# EAGLE design lm386_nogainctl (EAGLE 7.4.0)
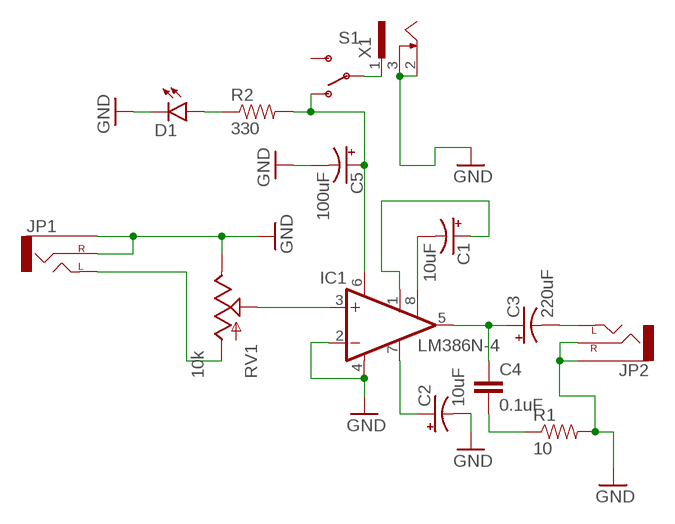
[diagram p0: schematic, sheet 1]

## Parts
C1  10uF  CAP_POLPTH2  [CPOL-RADIAL-10UF-25V]
C2  10uF  CAP_POLPTH2  [CPOL-RADIAL-10UF-25V]
C3  220uF  CAP_POLPTH2  [CPOL-RADIAL-10UF-25V]
C4  0.1uF  CAPPTH2  [CAP-PTH-SMALL2]
C5  100uF  100UF-25V-20%(PTH)  [CPOL-RADIAL-100UF-25V]
D1  LED3MM  [LED3MM]
IC1  LM386N-4  [DIL08]
JP1  AUDIO-JACKPTH  [AUDIO-JACK]
JP2  AUDIO-JACKPTH  [AUDIO-JACK]
R1  10  RESISTORPTH-1/4W  [AXIAL-0.4]
R2  330  RESISTORPTH-1/4W  [AXIAL-0.4]
RV1  10k  POT  [ALPS_POT]
S1  SWITCH-SPDTPTH_LOCK  [SWITCH-SPDT_LOCK.007S]
X1  SCD-014A  [SCD-014-A]

## Nets
GND: C2.2(-) C5.2(-) D1.K(C) IC1.2(-IN) IC1.4(GND) JP1.RING(RIGHT) JP1.SLEEVE JP2.RING(RIGHT) JP2.SLEEVE R1.P$2 RV1.P$1(E) X1.2 X1.3
N$1: JP1.TIP(LEFT) RV1.P$3(A)
N$2: IC1.3(+IN) RV1.P$2(S)
N$3: S1.2(P) X1.1
N$4: C5.1(+) IC1.6(VS) R2.P$2 S1.1(O)
N$5: C1.1(+) IC1.1(GAIN)
N$6: C1.2(-) IC1.8(GAIN)
N$7: C2.1(+) IC1.7(BYPASS)
N$8: C3.1(+) C4.1 IC1.5(OUT)
N$9: C4.2 R1.P$1
N$10: D1.A R2.P$1
N$11: C3.2(-) JP2.TIP(LEFT)
Unconnected: S1.3(S)

## Library data of the parts
C1-C3 = SparkFun-Passives:CAP_POL: Capacitor Polarized These are standard SMD and PTH capacitors. Normally 10uF, 47uF, and 100uF in electrolytic and tantalum varieties. Always verify the external diameter of the through hole cap, it varies with capacity, voltage, and manufacturer. The EIA devices should be standard.
C4 = SparkFun-Capacitors:CAP: Capacitor Standard 0603 ceramic capacitor, and 0.1" leaded capacitor.
C5 = SparkFun-Capacitors:100UF-25V-20%(PTH): CAP-08439; PROD_ID: CAP-08439
D1 = SparkFun-LED:LED: LEDs Standard schematic elements and footprints for 5mm, 3mm, 1206, and 0603 sized LEDs. 5mm - Spark Fun Electronics SKU : COM-00529 (and others)
IC1 = linear:LM386?-*: Low Voltage Audio Power Amplifier Source: http://cache.national.com/ds/LM/LM386.pdf
JP1 JP2 = SparkFun-Connectors:AUDIO-JACK: 3.5mm Audio Jack Simple 3.5mm common PCB mount audio jack. Variant PTH is our storefront SKU PRT-08032
R1 = SparkFun-Passives:RESISTOR: Resistor Basic schematic elements and footprints for 0603, 1206, and PTH resistors.
R2 = SparkFun-Resistors:RESISTOR: Resistor Basic schematic elements and footprints for 0603, 1206, and PTH resistors.
RV1 = SparkFun-Electromechanical:POT; PROD_ID: RES-09177
S1 = SparkFun-Electromechanical:SWITCH-SPDT: SPDT Switch Simple slide switch, Spark Fun Electronics SKU : COM-00102 DPDT SMT slide switch, AYZ0202, SWCH-08179
X1 = con-shiua-chyuan:SCD-014A: Power Jack 2.5mm; OC_FARNELL: unknown; OC_NEWARK: unknown

## Board
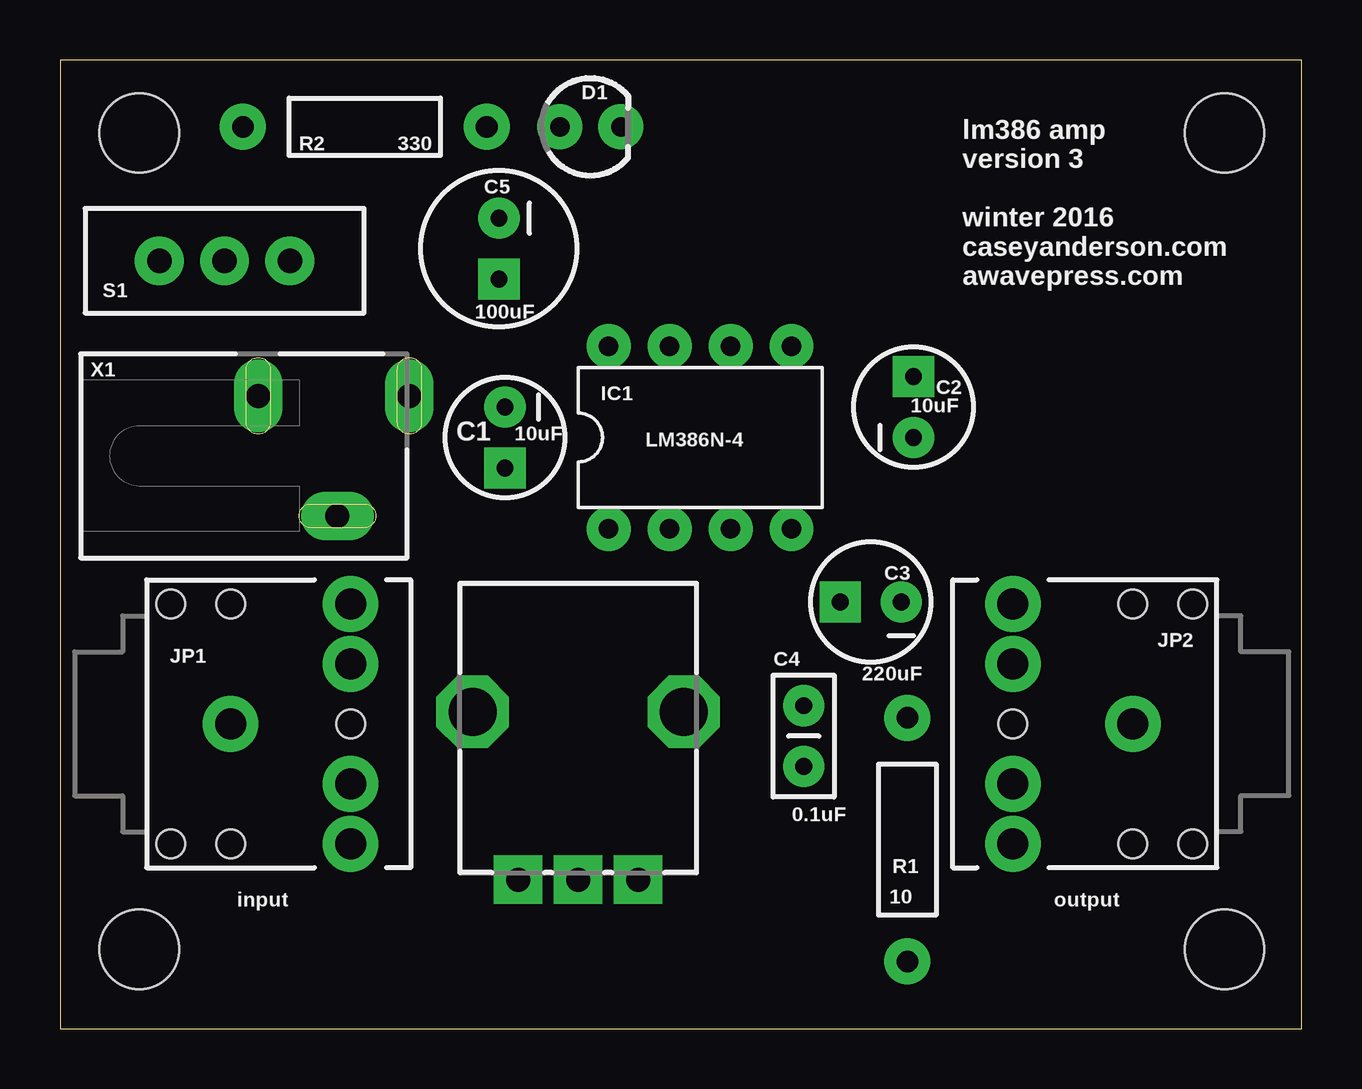
[diagram p1: board, top side]
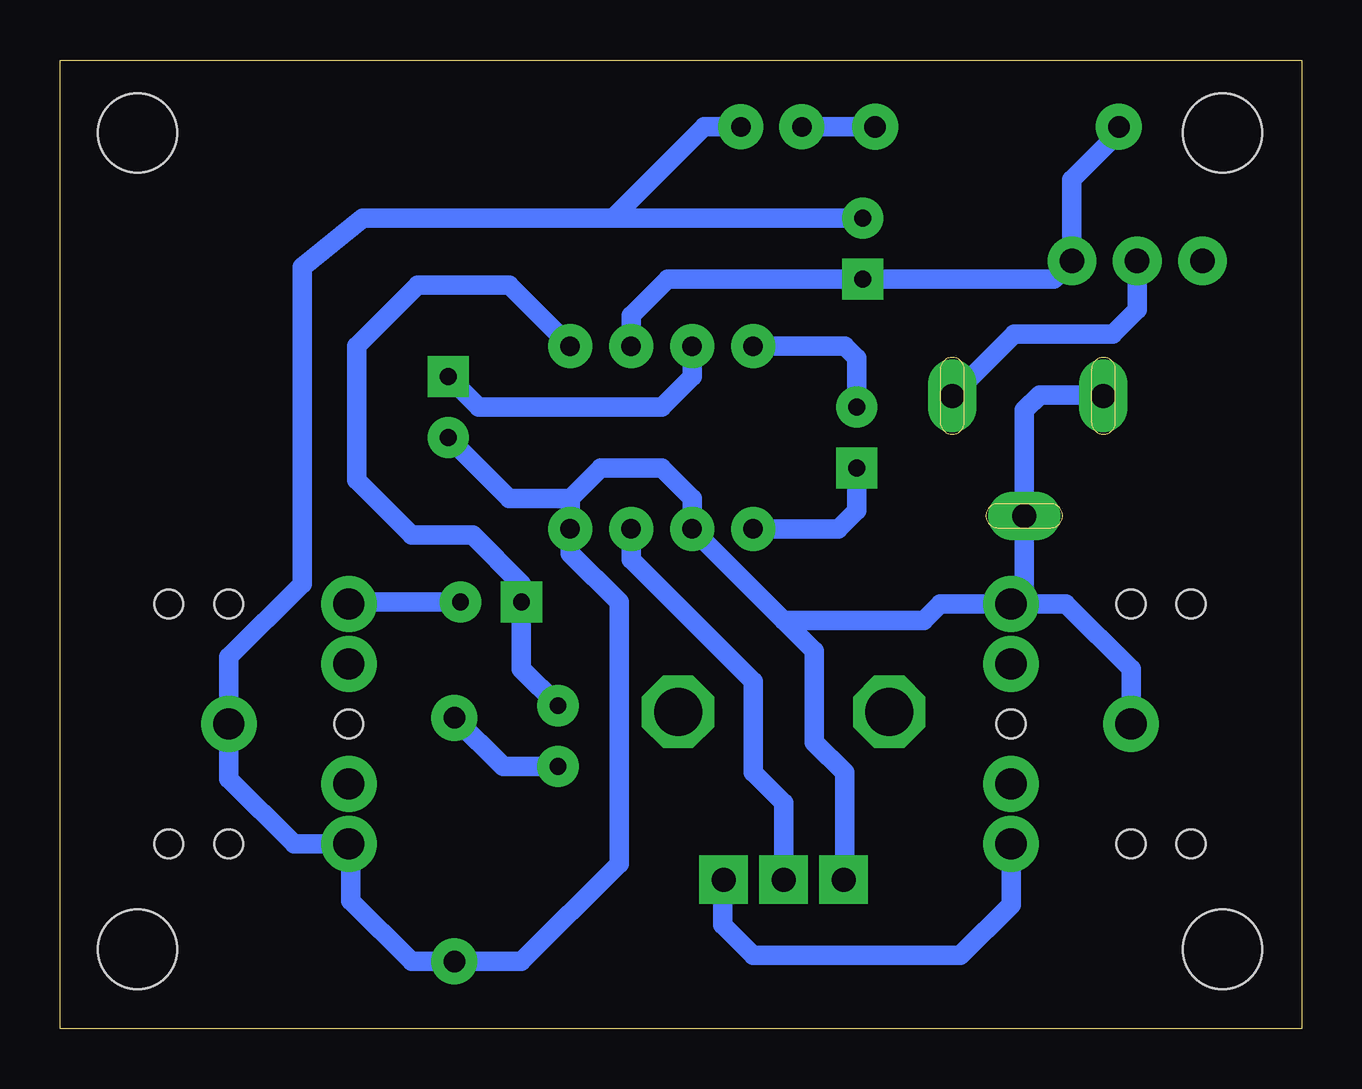
[diagram p2: board, bottom side, seen from below]

Size 51.74 x 40.38 mm. Coordinates in mm from the lower left corner, seen from the top.
Outline: 0,0 51.74,0 51.74,40.38 0,40.38 0,0
Copper layers (1*16): Top 0.035mm / dielectric 1.5mm / Bottom 0.035mm
Design rules "Othermill-DRC-1-64 *": minimum track width 8mil, minimum drill 0.8mm, track to track 0.39878125mm, track to pad 0.39878125mm, pad to pad 0.39878125mm, via to via 0.39878125mm, smd to smd 0mil, copper to edge 0mil, drill to drill 1mil, minimum pad ring 20mil, minimum via ring 10mil, stop-mask expansion 1mil, vias tented up to drill 30mil, thermal gap 10mil

### Footprints (pad centres in the part's own frame; a part is rotated, then mirrored left to right if it is on the bottom)
CPOL-RADIAL-10UF-25V = drill 0.7 pad 1.651 square: 1 1.27,0 | drill 0.7 pad 1.651: 2 -1.27,0
CAP-PTH-SMALL2 = drill 0.7 pad 1.651: 1 0,0; 2 2.54,0
CPOL-RADIAL-100UF-25V = drill 0.7 pad 1.651 square: 1 1.27,0 | drill 0.7 pad 1.651: 2 -1.27,0
LED3MM = drill 0.813 pad 1.88: A -1.27,0; K 1.27,0
DIL08 = drill 0.813 pad 1.27: 1 -3.81,-3.81; 2 -1.27,-3.81; 3 1.27,-3.81; 4 3.81,-3.81; 5 3.81,3.81; 6 1.27,3.81; 7 -1.27,3.81; 8 -3.81,3.81
AUDIO-JACK = drill 1.3 pad 2.184: RING 5,5; RSH 5,2.5; SLEEVE 0,0; TIP 5,-5; TSH 5,-2.5 | hole 1.2: 0,5; -2.5,5; -2.5,-5; 0,-5; 5,0
AXIAL-0.4 = drill 0.9 pad 1.88: P$1 -5.08,0; P$2 5.08,0
ALPS_POT = drill 1 pad 1.88 square: P$1 7,-2.5; P$2 7,0; P$3 7,2.5 | drill 2 octagon: P$4 0,-4.4; P$5 0,4.4
SWITCH-SPDT_LOCK.007S = drill 1.016 pad 1.88: 1 0,2.718; 2 0,0; 3 0,-2.718
STAND-OFF = hole 3.302: 0,0
SCD-014-A = drill 1 pad 2 long: 1 -2.5,13.8; 2 -2.5,7.5; 3 2.5,10.8

### Placement (x,y rotation side)
C1  18.54,24.64 270 top
C2  35.56,25.91 90 top
C3  33.78,17.78 180 top
C4  30.99,13.46 270 top
C5  18.29,32.51 270 top
D1  22.1,37.59 0 top
IC1  26.67,24.64 0 top
JP1  7.11,12.7 0 top
JP2  44.7,12.7 180 top
R1  35.31,7.87 270 top
R2  12.7,37.59 180 top
RV1  21.59,13.21 270 top
S1  6.86,32 270 top
U$1  [STAND-OFF]  3.3,37.34 0 top
U$2  [STAND-OFF]  48.51,37.34 0 top
U$3  [STAND-OFF]  48.51,3.3 0 top
U$4  [STAND-OFF]  3.3,3.3 0 top
X1  0.76,23.88 270 top

### Tracks (layer width: path | path; a pad name or v marks a point on that pad's centre or on a via)
GND
  Bottom 0.813: 30.48,22.1 29.21,23.37 26.67,23.37 25.4,22.1 IC1.2 21.59,17.02 | 30.48,22.1 IC1.4 30.48,19.81 28.45,17.78 28.45,6.86 32.51,2.79 R1.P$2 37.08,2.79 39.62,5.33 39.62,7.62 JP2.RING 41.99,7.7 44.7,10.41 JP2.SLEEVE 44.7,15.49 41.66,18.54 41.66,31.75 39.12,33.78 28.7,33.78 | 21.59,17.02 15.75,17.02 15.07,17.7 JP1.RING | RV1.P$1 19.05,6.21 19.05,10.67 20.32,11.94 20.32,15.75 21.59,17.02 | C5.2 28.7,33.78 | D1.K 24.89,37.59 28.7,33.78 | JP1.RING 9.83,17.7 7.11,14.99 JP1.SLEEVE | 30.48,22.1 33.02,22.1 C2.2 | JP1.RING 11.56,18.25 X1.3 11.56,25.78 10.92,26.42 8.3,26.42 X1.2
N$1
  Bottom 0.813: RV1.P$3 24.13,4.9 24.13,4.32 22.86,3.05 14.22,3.05 12.11,5.16 JP1.TIP
N$2
  Bottom 0.813: RV1.P$2 21.59,9.4 22.86,10.67 22.86,14.48 27.94,19.56 IC1.3
N$3
  Bottom 0.813: X1.1 11.98,28.96 7.87,28.96 6.86,29.97 S1.2
N$4
  Bottom 0.813: IC1.6 27.94,29.72 26.42,31.24 C5.1 10.34,31.24 S1.1 9.58,35.38 7.62,37.34 R2.P$2
N$5
  Bottom 0.813: IC1.1 19.3,20.83 18.54,21.59 C1.1
N$6
  Bottom 0.813: IC1.8 19.05,28.45 18.54,27.94 C1.2
N$7
  Bottom 0.813: IC1.7 25.4,27.18 26.67,25.91 34.29,25.91 C2.1
N$8
  Bottom 0.813: IC1.5 33.02,30.99 36.83,30.99 39.37,28.45 39.37,22.86 37.08,20.57 34.54,20.57 32.51,18.54 C3.1 32.51,14.99 C4.1
N$9
  Bottom 0.813: C4.2 33.27,10.92 R1.P$1
N$10
  Bottom 0.813: R2.P$1 D1.A
N$11
  Bottom 0.813: C3.2 39.62,17.78 JP2.TIP

### Text on the board
tPlace: lm386 amp / version 3 / / winter 2016 / caseyanderson.com / awavepress.com | input | output